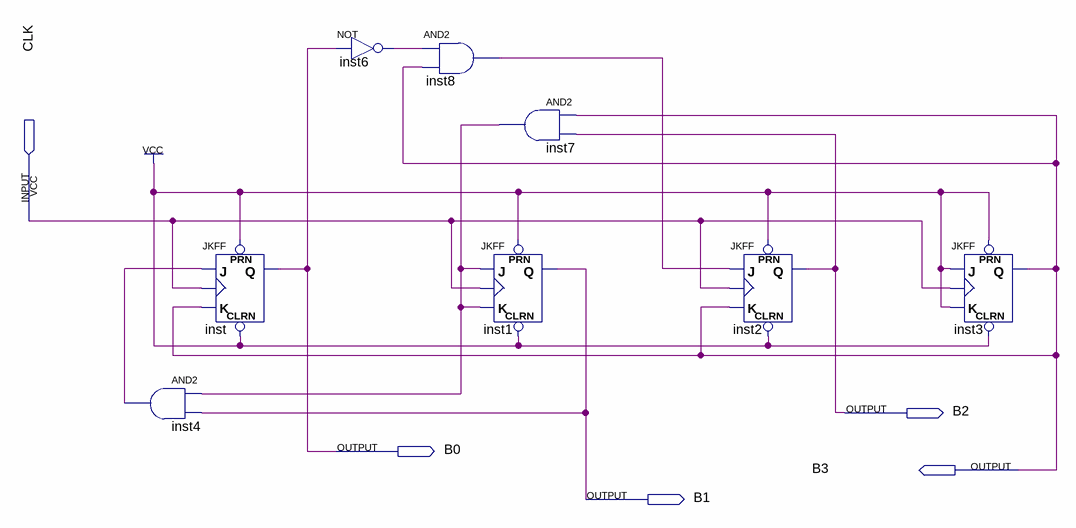
[diagram p0: schematic sheet]
// Quartus schematic Exemplo3.bdf as structural Verilog: 8 symbols, 5 pins
module Exemplo3 (
  input  CLK,
  output B2,
  output B0,
  output B3,
  output B1
);

  wire inst4_out, inst6_out, inst7_out, inst8_out;

  and inst4 (inst4_out, inst7_out, B1);
  JKFF inst (.PRN(1'b1), .CLRN(1'b1), .K(B3), .J(inst4_out), .CLK(CLK), .Q(B0));
  not inst6 (inst6_out, B0);
  and inst8 (inst8_out, inst6_out, B3);
  and inst7 (inst7_out, B3, B2);
  JKFF inst1 (.PRN(1'b1), .CLRN(1'b1), .K(inst7_out), .J(inst7_out), .CLK(CLK), .Q(B1));
  JKFF inst2 (.PRN(1'b1), .CLRN(1'b1), .K(B3), .J(inst8_out), .CLK(CLK), .Q(B2));
  JKFF inst3 (.PRN(1'b1), .CLRN(1'b1), .K(1'b1), .J(1'b1), .CLK(CLK), .Q(B3));
endmodule
